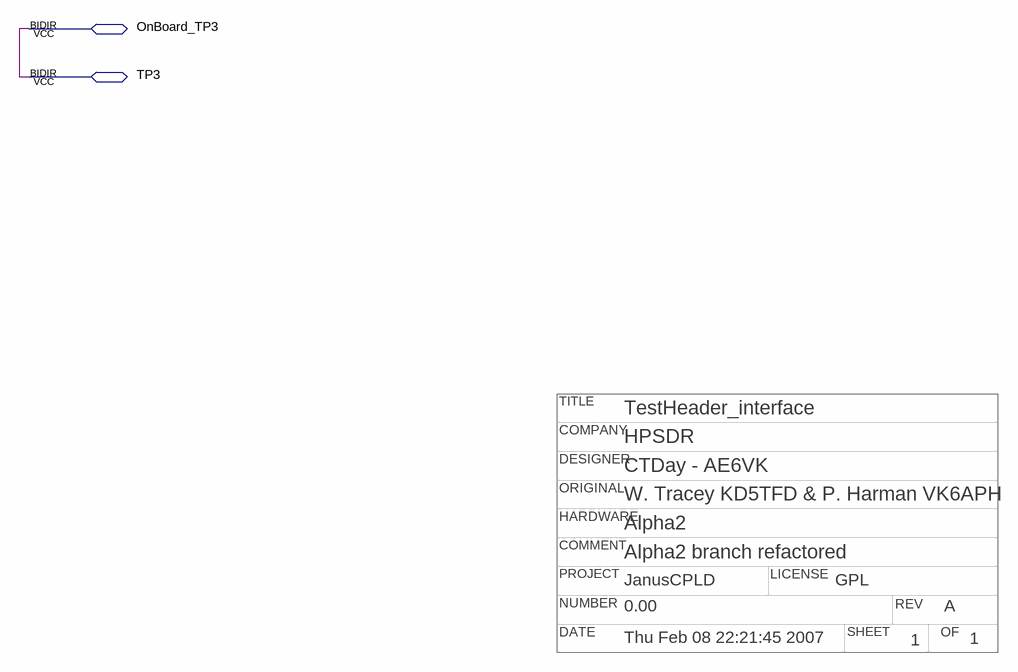
[diagram p0: schematic sheet]
// Quartus schematic TestHeader_interface.bdf as structural Verilog: 0 symbols, 2 pins
// Title block: TITLE: TestHeader_interface; COMPANY: HPSDR; DESIGNER: CTDay - AE6VK; NUMBER: 0.00; REV: A; DATE: Thu Feb 08 22:21:45 2007; SHEET: 1; OF: 1; ORIGINAL: W. Tracey KD5TFD & P. Harman VK6APH; HARDWARE: Alpha2; COMMENT: Alpha2 branch refactored; PROJECT: JanusCPLD; LICENSE: GPL
module TestHeader_interface (
  inout  OnBoard_TP3,
  inout  TP3
);


  assign TP3 = OnBoard_TP3;
endmodule
